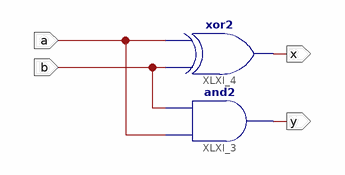
[diagram p0: schematic sheet 1]
// Xilinx ISE schematic LAB06_01.sch (spartan6) as structural Verilog: 2 symbols, 4 ports
module LAB06_01 (
  input  b,
  input  a,
  output x,
  output y
);

  and XLXI_3 (y, a, b);
  xor XLXI_4 (x, b, a);
endmodule
